# EAGLE schematic PAC-S10 & S1 SSUB (EAGLE 9.6.2)

## Sheet 1 of 4
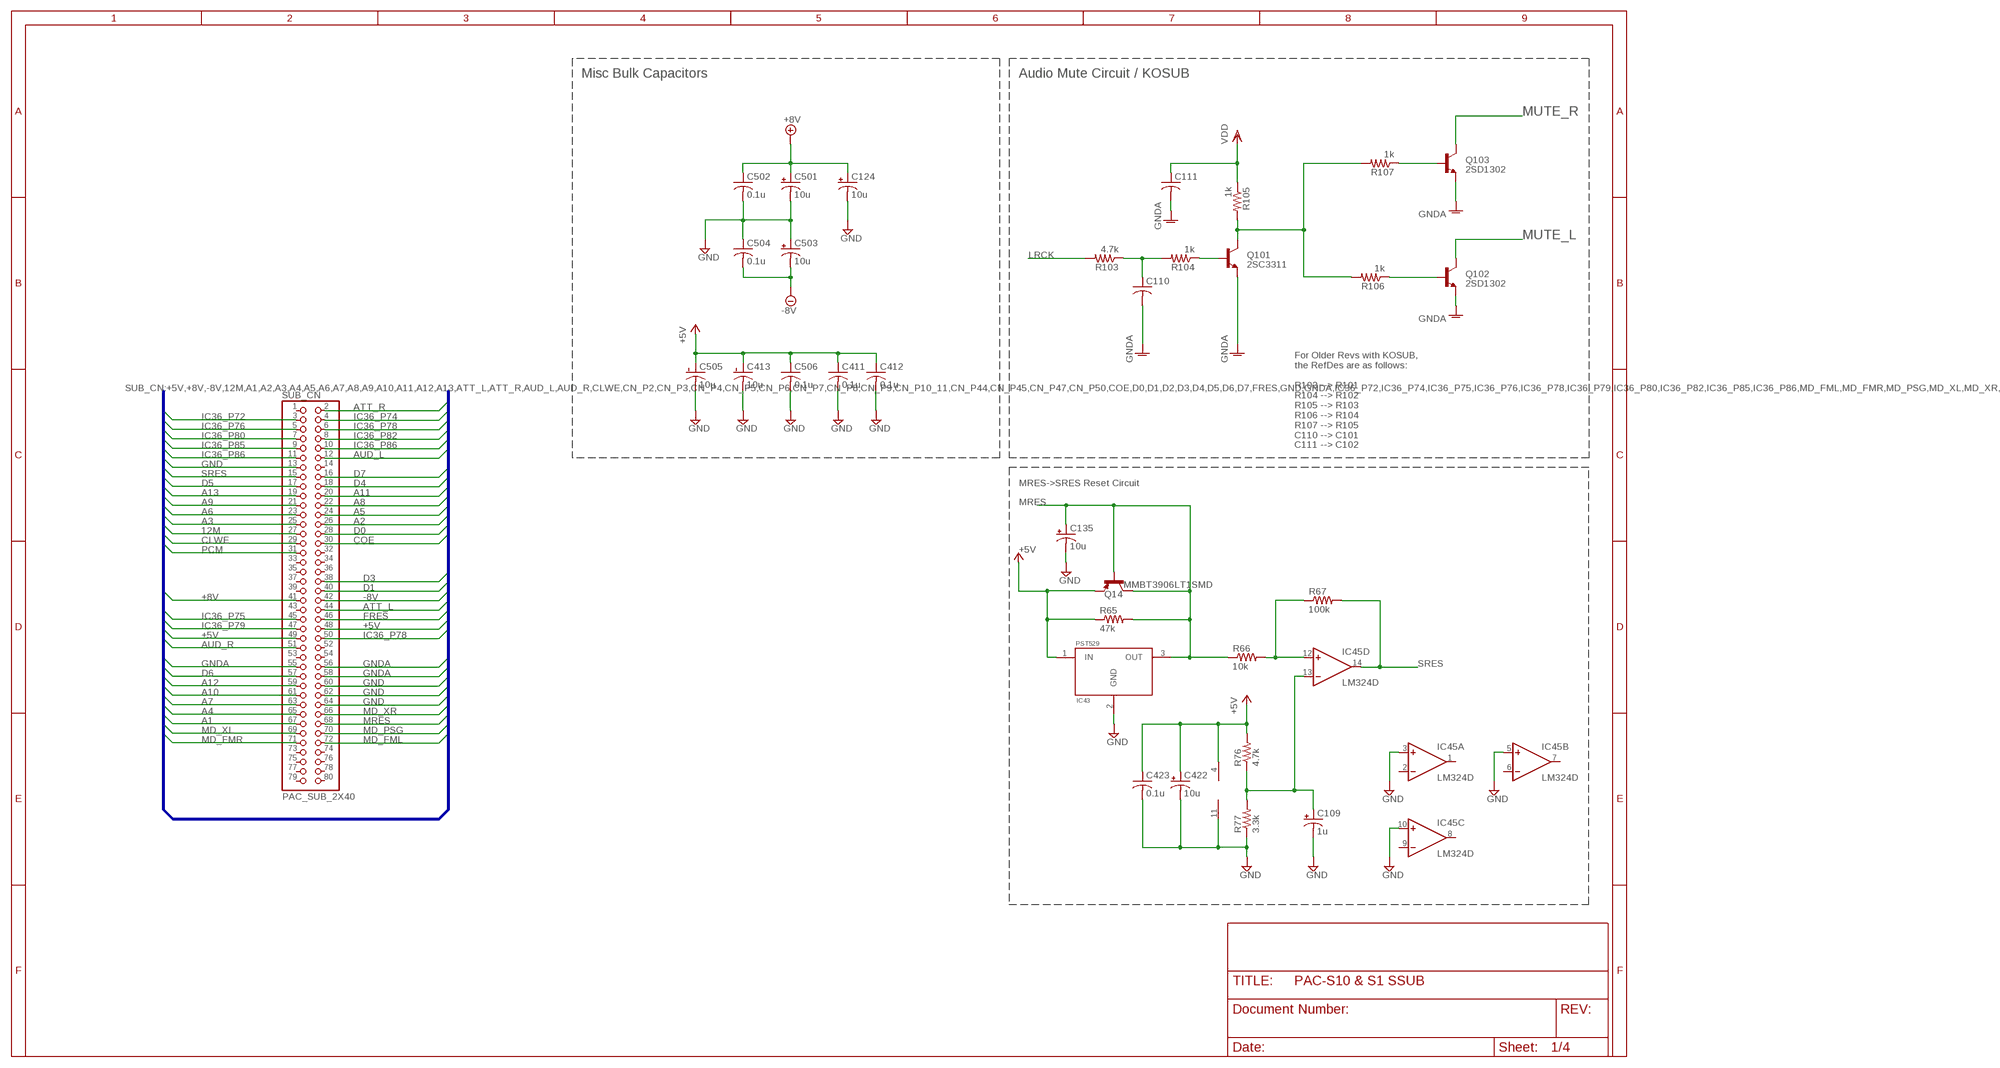
[diagram p0: schematic, sheet 1]

### Parts
C109  1u  CPOL-USB  [PANASONIC_B]
C110  C-USC1210  [C1210]
C111  C-USC0805  [C0805]
C124  10u  CPOL-USB  [PANASONIC_B]
C135  10u  CPOL-USB  [PANASONIC_B]
C411  0.1u  C-USC0805  [C0805]
C412  0.1u  C-USC0805  [C0805]
C413  10u  CPOL-USB  [PANASONIC_B]
C422  10u  CPOL-USB  [PANASONIC_B]
C423  0.1u  C-USC0805  [C0805]
C501  10u  CPOL-USB  [PANASONIC_B]
C502  0.1u  C-USC0805  [C0805]
C503  10u  CPOL-USB  [PANASONIC_B]
C504  0.1u  C-USC0805  [C0805]
C505  10u  CPOL-USB  [PANASONIC_B]
C506  0.1u  C-USC0805  [C0805]
IC43  PST529  [TO92-]
IC45  LM324D  [SO14]
Q14  MMBT3906LT1SMD  [SOT23-BEC]
Q101  MMBT3904LT1-NPN-SOT23-BEC  [SOT23-BEC]
Q102  MMBT3904LT1-NPN-SOT23-BEC  [SOT23-BEC]
Q103  MMBT3904LT1-NPN-SOT23-BEC  [SOT23-BEC]
R65  47k  R-US_R0805  [R0805]
R66  10k  R-US_R0805  [R0805]
R67  100k  R-US_R0805  [R0805]
R76  4.7k  R-US_R0805  [R0805]
R77  3.3k  R-US_R0805  [R0805]
R103  4.7k  R-US_R0805  [R0805]
R104  1k  R-US_R0805  [R0805]
R105  1k  R-US_R0805  [R0805]
R106  1k  R-US_R0805  [R0805]
R107  1k  R-US_R0805  [R0805]
SUB_CN  PAC_SUB_2X40  [2X40_STG]

### Nets
12M: SUB_CN.27 ; also sheet 3
+5V: C411.1 C412.1 C413.+ C422.+ C423.1 C505.+ C506.1 IC43.1(IN) IC45.4(P:V+) Q14.E R65.1 R76.2 SUB_CN.48 SUB_CN.49 ; also sheet 2,3
+8V: C124.+ C501.+ C502.1 SUB_CN.41 ; also sheet 2,3,4
-8V: C503.- C504.2 SUB_CN.42 ; also sheet 2,4
A1: SUB_CN.67 ; also sheet 3
A2: SUB_CN.26 ; also sheet 3
A3: SUB_CN.25 ; also sheet 3
A4: SUB_CN.65 ; also sheet 3
A5: SUB_CN.24 ; also sheet 3
A6: SUB_CN.23 ; also sheet 3
A7: SUB_CN.63 ; also sheet 3
A8: SUB_CN.22 ; also sheet 3
A9: SUB_CN.21 ; also sheet 3
A10: SUB_CN.61 ; also sheet 3
A11: SUB_CN.20 ; also sheet 3
A12: SUB_CN.59 ; also sheet 3
A13: SUB_CN.19 ; also sheet 3
ATT_L: SUB_CN.44 ; also sheet 2
ATT_R: SUB_CN.2 ; also sheet 2
AUD_L: SUB_CN.12 ; also sheet 4
AUD_R: SUB_CN.51 ; also sheet 4
CLWE: SUB_CN.29 ; also sheet 3
COE: SUB_CN.30 ; also sheet 3
D0: SUB_CN.28 ; also sheet 3
D1: SUB_CN.40 ; also sheet 3
D3: SUB_CN.38 ; also sheet 3
D4: SUB_CN.18 ; also sheet 3
D5: SUB_CN.17 ; also sheet 3
D6: SUB_CN.57 ; also sheet 3
D7: SUB_CN.16 ; also sheet 3
FRES: SUB_CN.46 ; also sheet 3
GND: C109.- C124.- C135.- C411.2 C412.2 C413.- C422.- C423.2 C501.- C502.2 C503.+ C504.1 C505.- C506.2 IC43.2(GND) IC45.3(A:+IN) IC45.5(B:+IN) IC45.10(C:+IN) IC45.11(P:V-) R77.1 SUB_CN.13 SUB_CN.60 SUB_CN.62 SUB_CN.64 ; also sheet 2,3
GNDA: C110.2 C111.2 Q101.E Q102.E Q103.E SUB_CN.55 SUB_CN.56 SUB_CN.58 ; also sheet 3,4
IC36_P72: SUB_CN.3 ; also sheet 2
IC36_P74: SUB_CN.4 ; also sheet 2
IC36_P75: SUB_CN.45 ; also sheet 2
IC36_P76: SUB_CN.5 ; also sheet 2
IC36_P78: SUB_CN.6 SUB_CN.50 ; also sheet 2
IC36_P79: SUB_CN.47 ; also sheet 2
IC36_P80: SUB_CN.7 ; also sheet 2
IC36_P82: SUB_CN.8 ; also sheet 2
IC36_P85: SUB_CN.9 ; also sheet 2
IC36_P86: SUB_CN.10 SUB_CN.11 ; also sheet 2
LRCK: R103.2 ; also sheet 3
MD_FML: SUB_CN.72 ; also sheet 4
MD_FMR: SUB_CN.71 ; also sheet 4
MD_PSG: SUB_CN.70 ; also sheet 4
MD_XL: SUB_CN.69 ; also sheet 4
MD_XR: SUB_CN.66 ; also sheet 4
MRES: C135.+ IC43.3(OUT) Q14.B Q14.C R65.2 R66.1 SUB_CN.68
MUTE_L: Q102.C ; also sheet 4
MUTE_R: Q103.C ; also sheet 4
N$12: IC45.12(D:+IN) R66.2 R67.1
N$24: Q101.B R104.1
N$25: C110.1 R103.1 R104.2
N$26: C109.+ IC45.13(D:-IN) R76.1 R77.2
N$27: Q101.C R105.2 R106.2 R107.2
N$29: Q102.B R106.1
N$30: Q103.B R107.1
PCM: SUB_CN.31 ; also sheet 3
SRES: IC45.14(D:OUT) R67.2 SUB_CN.15
VDD: C111.1 R105.1 ; also sheet 3
Unconnected: IC45.1(A:OUT) IC45.2(A:-IN) IC45.6(B:-IN) IC45.7(B:OUT) IC45.8(C:OUT) IC45.9(C:-IN) SUB_CN.1 SUB_CN.14 SUB_CN.32 SUB_CN.33 SUB_CN.34 SUB_CN.35 SUB_CN.36 SUB_CN.37 SUB_CN.39 SUB_CN.43 SUB_CN.52 SUB_CN.53 SUB_CN.54 SUB_CN.73 SUB_CN.74 SUB_CN.75 SUB_CN.76 SUB_CN.77 SUB_CN.78 SUB_CN.79 SUB_CN.80

### Buses
SUB_CN:+5V,+8V,-8V,12M,A1,A2,A3,A4,A5,A6,A7,A8,A9,A10,A11,A12,A13,ATT_L,ATT_R,AUD_L,AUD_R,CLWE,CN_P2,CN_P3,CN_P4,CN_P5,CN_P6,CN_P7,CN_P8,CN_P9,CN_P10_11,CN_P44,CN_P45,CN_P47,CN_P50,COE,D0,D1,D2,D3,D4,D5,D6,D7,FRES,GND,GNDA,IC36_P72,IC36_P74,IC36_P75,IC36_P76,IC36_P78,IC36_P79,IC36_P80,IC36_P82,IC36_P85,IC36_P86,MD_FML,MD_FMR,MD_PSG,MD_XL,MD_XR,MRES,PCM,SRES

### Notes on the sheet
- Misc Bulk Capacitors | Audio Mute Circuit / KOSUB
- 2SD1302
- 2SC3311
- 2SD1302
- For Older Revs with KOSUB,
  the RefDes are as follows:
  
  R103 --> R101
  R104 --> R102
  R105 --> R103
  R106 --> R104
  R107 --> R105
  C110 --> C101
  C111 --> C102
- MRES->SRES Reset Circuit

## Sheet 2 of 4
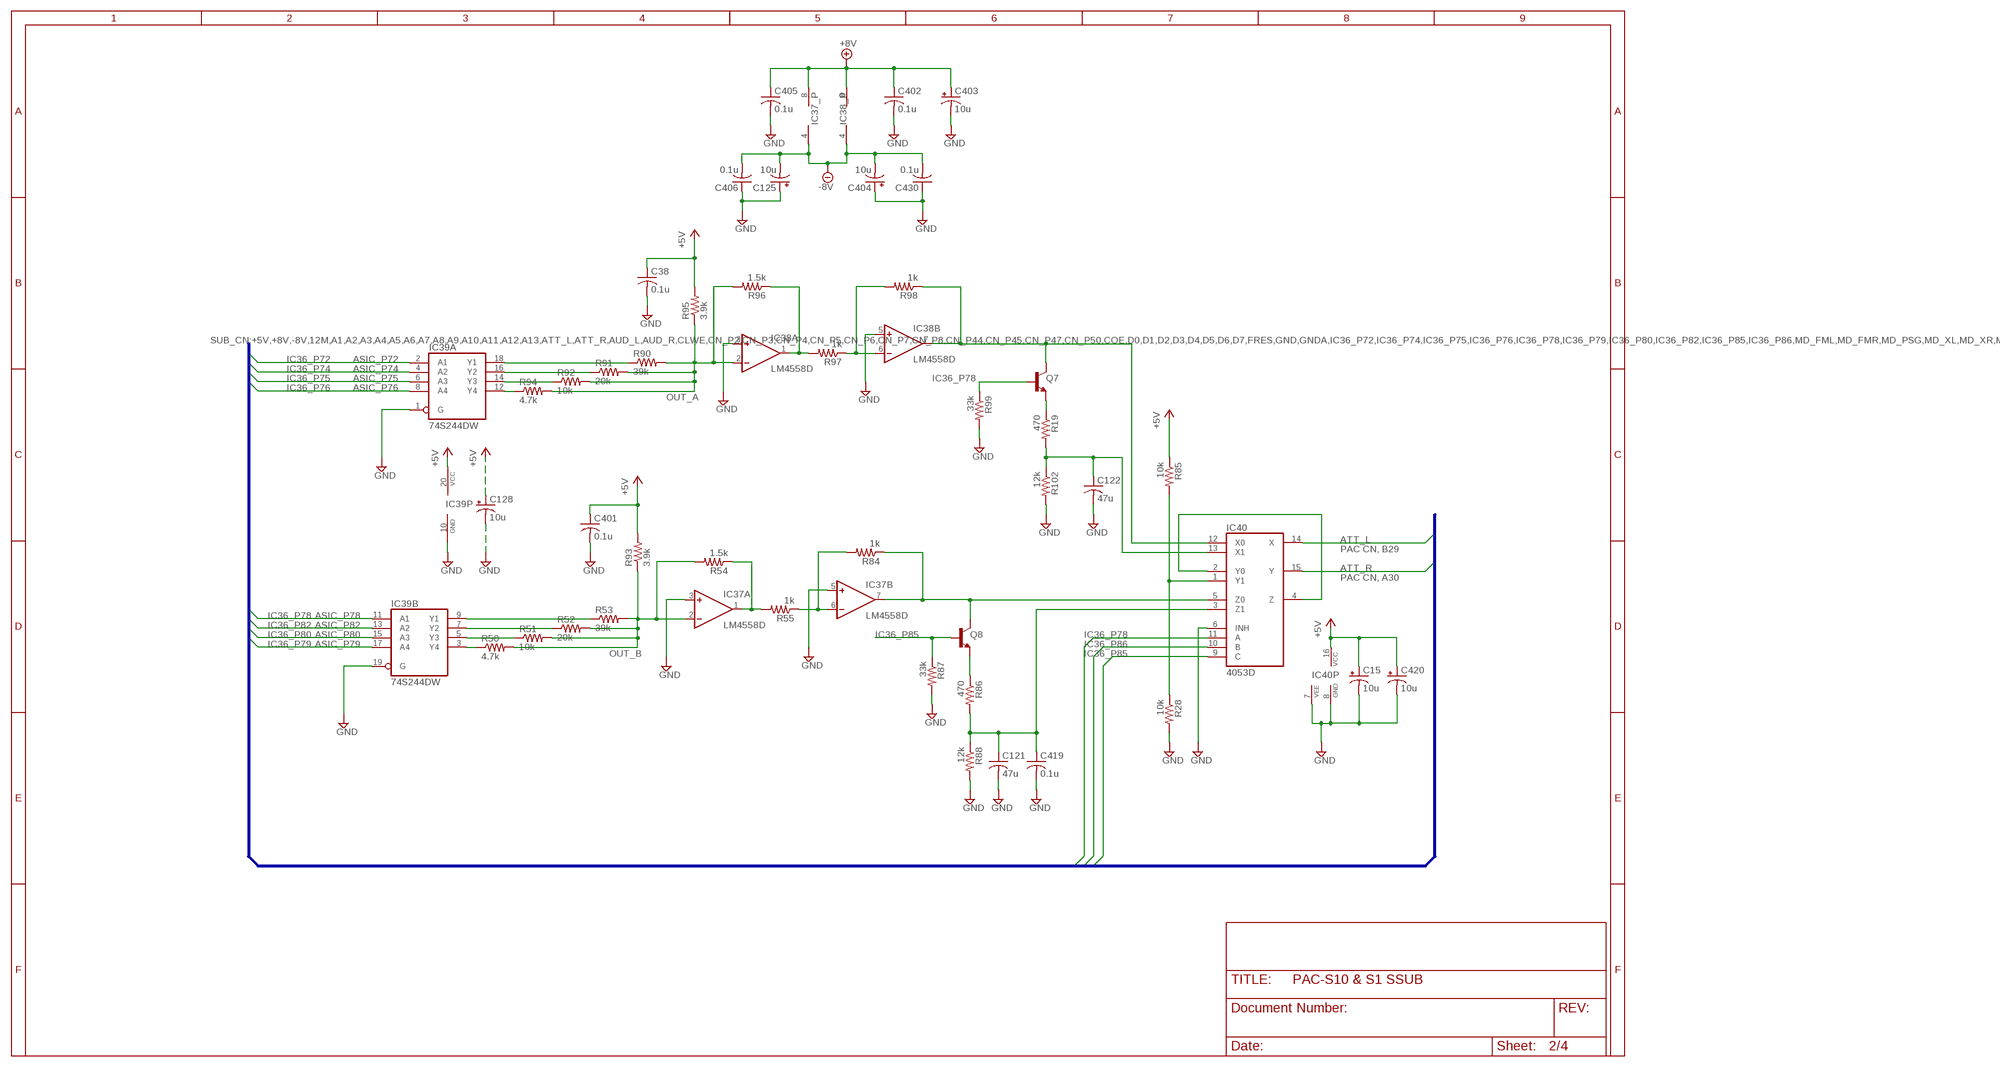
[diagram p1: schematic, sheet 2]

### Parts
C15  10u  CPOL-USB  [PANASONIC_B]
C38  0.1u  C-USC0805  [C0805]
C121  47u  C-USC2220K  [C2220K]
C122  47u  C-USC2220K  [C2220K]
C125  10u  CPOL-USB  [PANASONIC_B]
C128  10u  CPOL-USB  [PANASONIC_B]
C401  0.1u  C-USC0805  [C0805]
C402  0.1u  C-USC0805  [C0805]
C403  10u  CPOL-USB  [PANASONIC_B]
C404  10u  CPOL-USB  [PANASONIC_B]
C405  0.1u  C-USC0805  [C0805]
C406  0.1u  C-USC0805  [C0805]
C419  0.1u  C-USC0805  [C0805]
C420  10u  CPOL-USB  [PANASONIC_B]
C430  0.1u  C-USC0805  [C0805]
IC37  LM4558D  [SO08]
IC38  LM4558D  [SO08]
IC39  74S244DW  [SO20W]
IC40  4053D  [SO16]
Q7  MMBT3904LT1-NPN-SOT23-BEC  [SOT23-BEC]
Q8  MMBT3904LT1-NPN-SOT23-BEC  [SOT23-BEC]
R19  470  R-US_R0805  [R0805]
R28  10k  R-US_R0805  [R0805]
R50  4.7k  R-US_R0805  [R0805]
R51  10k  R-US_R0805  [R0805]
R52  20k  R-US_R0805  [R0805]
R53  39k  R-US_R0805  [R0805]
R54  1.5k  R-US_R0805  [R0805]
R55  1k  R-US_R0805  [R0805]
R84  1k  R-US_R0805  [R0805]
R85  10k  R-US_R0805  [R0805]
R86  470  R-US_R0805  [R0805]
R87  33k  R-US_R0805  [R0805]
R88  12k  R-US_R0805  [R0805]
R90  39k  R-US_R0805  [R0805]
R91  20k  R-US_R0805  [R0805]
R92  10k  R-US_R0805  [R0805]
R93  3.9k  R-US_R0805  [R0805]
R94  4.7k  R-US_R0805  [R0805]
R95  3.9k  R-US_R0805  [R0805]
R96  1.5k  R-US_R0805  [R0805]
R97  1k  R-US_R0805  [R0805]
R98  1k  R-US_R0805  [R0805]
R99  33k  R-US_R0805  [R0805]
R102  12k  R-US_R0805  [R0805]

### Nets
+5V: C15.+ C38.1 C128.+ C401.1 C420.+ IC39.20(P:VCC) IC40.16(VCC) R85.1 R93.2 R95.2 ; also sheet 1,3
+8V: C402.1 C403.+ C405.1 IC37.8(P:V+) IC38.8(P:V+) ; also sheet 1,3,4
-8V: C125.- C404.- C406.2 C430.2 IC37.4(P:V-) IC38.4(P:V-) ; also sheet 1,4
ATT_L: IC40.14(X) ; also sheet 1
ATT_R: IC40.15(Y) ; also sheet 1
GND: C15.- C38.2 C121.2 C122.2 C125.+ C128.- C401.2 C402.2 C403.- C404.+ C405.2 C406.1 C419.2 C420.- C430.1 IC37.3(A:+IN) IC37.5(B:+IN) IC38.3(A:+IN) IC38.5(B:+IN) IC39.1(A:G) IC39.10(P:GND) IC39.19(B:G) IC40.6(INH) IC40.7(VEE) IC40.8(GND) R28.2 R87.2 R88.2 R99.2 R102.2 ; also sheet 1,3
IC36_P72: IC39.2(A:A1) ; also sheet 1
IC36_P74: IC39.4(A:A2) ; also sheet 1
IC36_P75: IC39.6(A:A3) ; also sheet 1
IC36_P76: IC39.8(A:A4) ; also sheet 1
IC36_P78: IC39.11(B:A1) IC40.11(A) Q7.B R99.1 ; also sheet 1
IC36_P79: IC39.17(B:A4) ; also sheet 1
IC36_P80: IC39.15(B:A3) ; also sheet 1
IC36_P82: IC39.13(B:A2) ; also sheet 1
IC36_P85: IC40.9(C) Q8.B R87.1 ; also sheet 1
IC36_P86: IC40.10(B) ; also sheet 1
IC40_P3: C121.1 C419.1 IC40.3(Z1) R86.2 R88.1
N$1: IC39.3(B:Y4) R50.1
N$2: IC39.5(B:Y3) R51.1
N$3: IC39.7(B:Y2) R52.1
N$4: IC39.9(B:Y1) R53.1
N$5: IC37.1(A:OUT) R54.1 R55.2
N$6: IC39.12(A:Y4) R94.1
N$7: IC39.14(A:Y3) R92.1
N$8: IC39.16(A:Y2) R91.1
N$9: IC39.18(A:Y1) R90.1
N$10: IC40.2(Y0) IC40.4(Z)
N$11: IC37.6(B:-IN) R55.1 R84.2
N$13: Q8.E R86.1
N$14: IC40.1(Y1) R28.1 R85.2
N$15: IC38.6(B:-IN) R97.1 R98.2
N$16: IC38.1(A:OUT) R96.1 R97.2
N$17: IC37.7(B:OUT) IC40.5(Z0) Q8.C R84.1
N$18: IC38.7(B:OUT) IC40.12(X0) Q7.C R98.1
N$19: Q7.E R19.1
N$20: C122.1 IC40.13(X1) R19.2 R102.1
OUT_A: IC38.2(A:-IN) R90.2 R91.2 R92.2 R94.2 R95.1 R96.2
OUT_B: IC37.2(A:-IN) R50.2 R51.2 R52.2 R53.2 R54.2 R93.1

### Buses
SUB_CN:+5V,+8V,-8V,12M,A1,A2,A3,A4,A5,A6,A7,A8,A9,A10,A11,A12,A13,ATT_L,ATT_R,AUD_L,AUD_R,CLWE,CN_P2,CN_P3,CN_P4,CN_P5,CN_P6,CN_P7,CN_P8,CN_P44,CN_P45,CN_P47,CN_P50,COE,D0,D1,D2,D3,D4,D5,D6,D7,FRES,GND,GNDA,IC36_P72,IC36_P74,IC36_P75,IC36_P76,IC36_P78,IC36_P79,IC36_P80,IC36_P82,IC36_P85,IC36_P86,MD_FML,MD_FMR,MD_PSG,MD_XL,MD_XR,MRES,PCM,SRES

### Notes on the sheet
- IC37_P | IC38_P
- ASIC_P72
- ASIC_P74
- ASIC_P75
- ASIC_P76
- PAC CN, B29
- PAC CN, A30
- ASIC_P78
- ASIC_P82
- ASIC_P80
- ASIC_P79

## Sheet 3 of 4
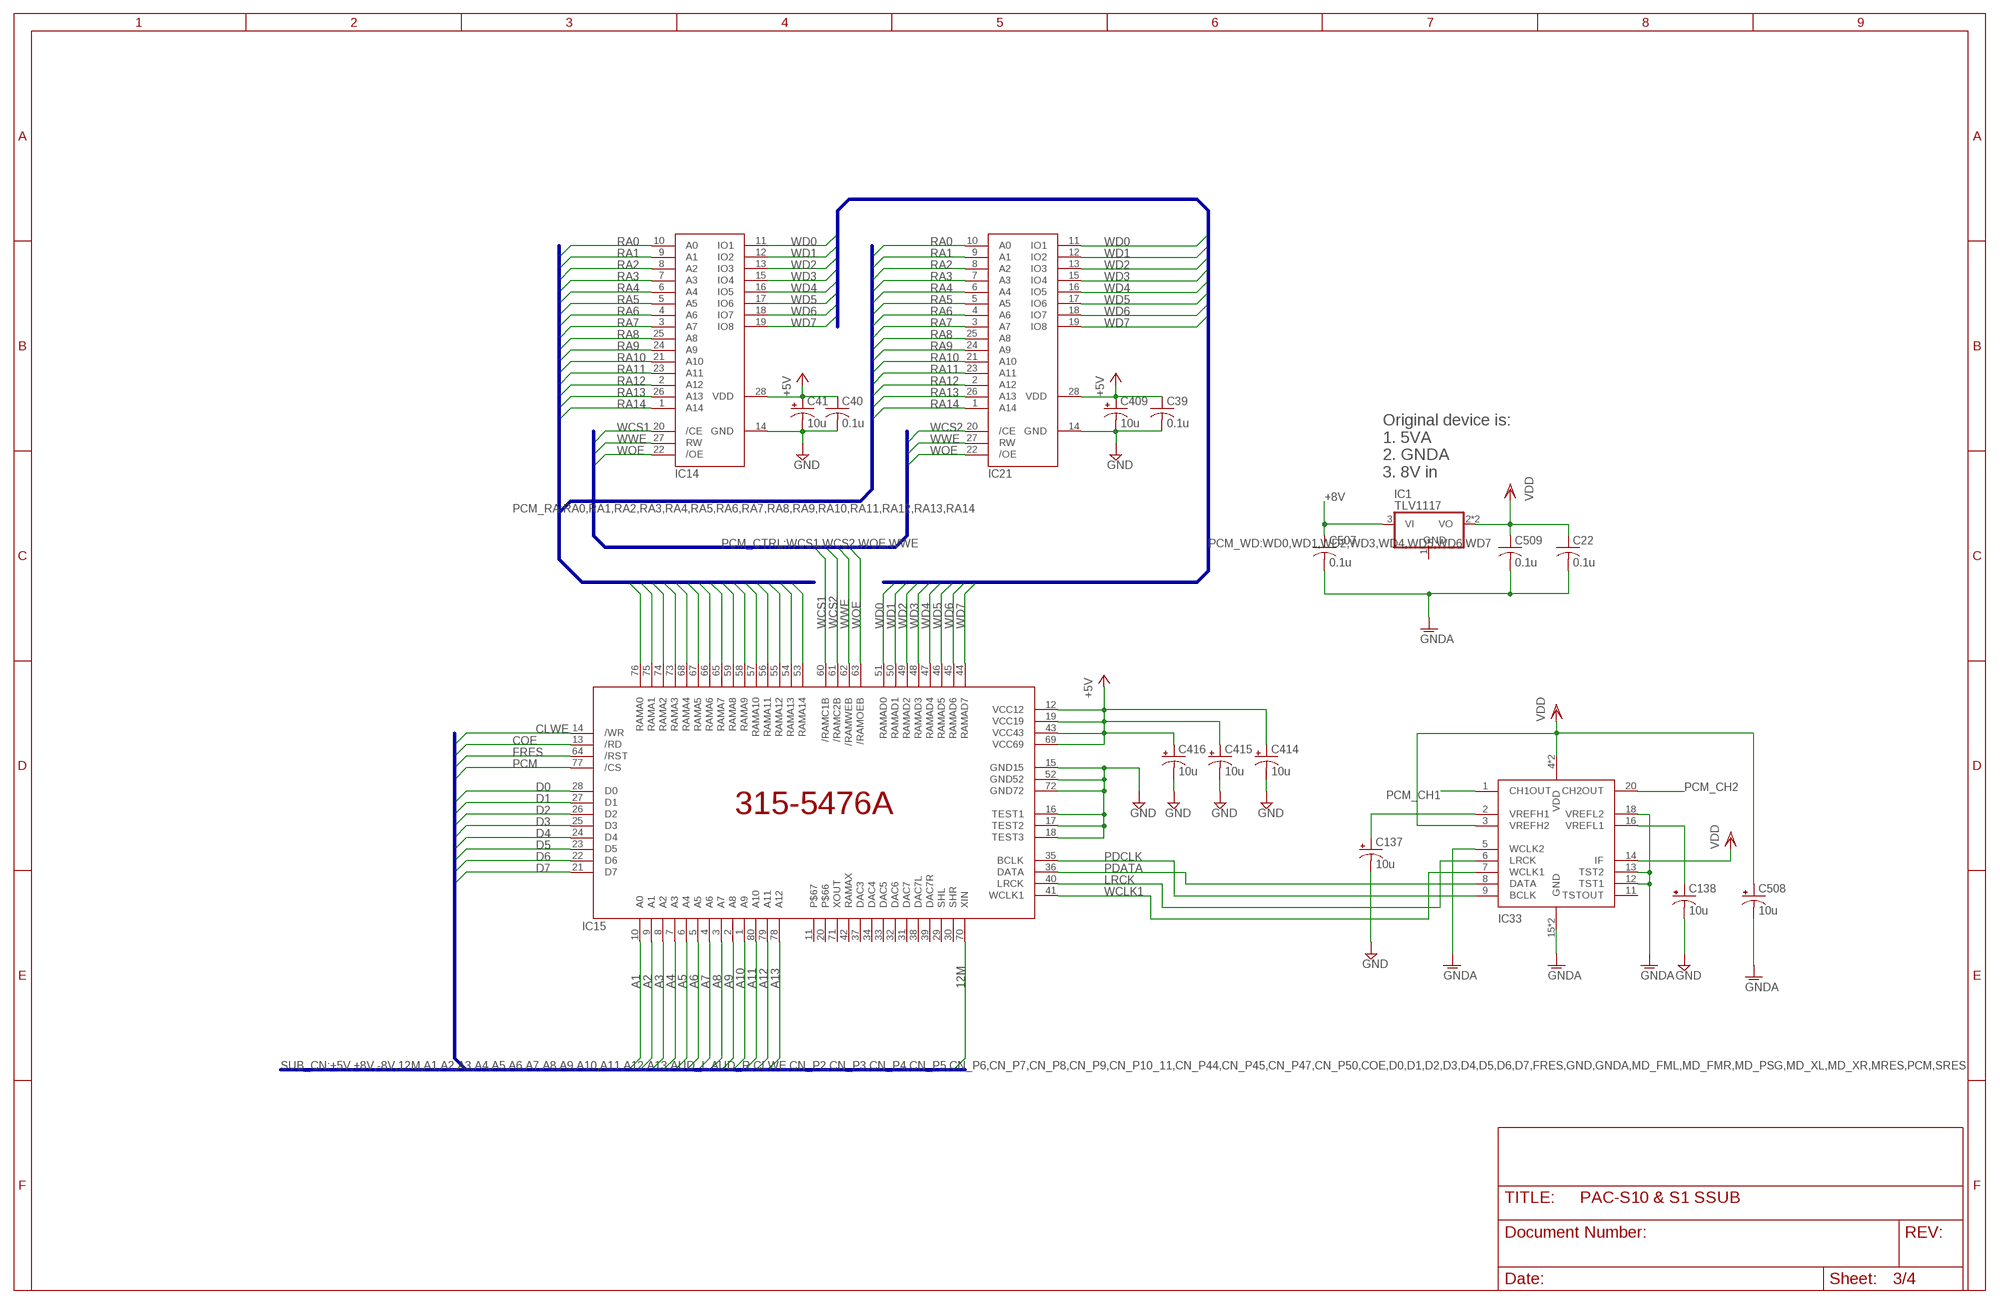
[diagram p2: schematic, sheet 3]

### Parts
C22  0.1u  C-USC0805  [C0805]
C39  0.1u  C-USC0805  [C0805]
C40  0.1u  C-USC0805  [C0805]
C41  10u  CPOL-USB  [PANASONIC_B]
C137  10u  CPOL-USB  [PANASONIC_B]
C138  10u  CPOL-USB  [PANASONIC_B]
C409  10u  CPOL-USB  [PANASONIC_B]
C414  10u  CPOL-USB  [PANASONIC_B]
C415  10u  CPOL-USB  [PANASONIC_B]
C416  10u  CPOL-USB  [PANASONIC_B]
C507  0.1u  C-USC0805  [C0805]
C508  10u  CPOL-USB  [PANASONIC_B]
C509  0.1u  C-USC0805  [C0805]
IC1  TLV1117  [SOT223]
IC14  TC51832F-10  [SOP28]
IC15  315-5476A  [QFP80R]
IC21  TC51832F-10  [SOP28]
IC33  LC7881M  [SOIC20S]

### Nets
12M: IC15.70(XIN) ; also sheet 1
+5V: C39.1 C40.1 C41.+ C409.+ C414.+ C415.+ C416.+ IC14.28(VDD) IC15.12(VCC12) IC15.19(VCC19) IC15.43(VCC43) IC15.69(VCC69) IC21.28(VDD) ; also sheet 1,2
+8V: C507.1 IC1.3(VI) ; also sheet 1,2,4
A1: IC15.10(A0) ; also sheet 1
A2: IC15.9(A1) ; also sheet 1
A3: IC15.8(A2) ; also sheet 1
A4: IC15.7(A3) ; also sheet 1
A5: IC15.6(A4) ; also sheet 1
A6: IC15.5(A5) ; also sheet 1
A7: IC15.4(A6) ; also sheet 1
A8: IC15.3(A7) ; also sheet 1
A9: IC15.2(A8) ; also sheet 1
A10: IC15.1(A9) ; also sheet 1
A11: IC15.80(A10) ; also sheet 1
A12: IC15.79(A11) ; also sheet 1
A13: IC15.78(A12) ; also sheet 1
CLWE: IC15.14(/WR) ; also sheet 1
COE: IC15.13(/RD) ; also sheet 1
D0: IC15.28(D0) ; also sheet 1
D1: IC15.27(D1) ; also sheet 1
D2: IC15.26(D2)
D3: IC15.25(D3) ; also sheet 1
D4: IC15.24(D4) ; also sheet 1
D5: IC15.23(D5) ; also sheet 1
D6: IC15.22(D6) ; also sheet 1
D7: IC15.21(D7) ; also sheet 1
FRES: IC15.64(/RST) ; also sheet 1
GND: C39.2 C40.2 C41.- C137.- C138.- C409.- C414.- C415.- C416.- IC14.14(GND) IC15.15(GND15) IC15.16(TEST1) IC15.17(TEST2) IC15.18(TEST3) IC15.52(GND52) IC15.72(GND72) IC21.14(GND) IC33.15(GND) IC33.17(GND) ; supply symbol labelled GNDA ; also sheet 1,2
GNDA: C22.2 C507.2 C508.- C509.2 IC33.5(WCLK2) IC33.12(TST1) IC33.13(TST2) IC33.18(VREFL2) ; also sheet 1,4
LRCK: IC15.40(LRCK) IC33.6(LRCK) ; also sheet 1
N$21: C138.+ IC33.16(VREFL1)
N$22: C137.+ IC33.2(VREFH1)
PCM: IC15.77(/CS) ; also sheet 1
PCM_CH1: IC33.1(CH1OUT) ; also sheet 4
PCM_CH2: IC33.20(CH2OUT) ; also sheet 4
PDATA: IC15.36(DATA) IC33.8(DATA)
PDCLK: IC15.35(BCLK) IC33.9(BCLK)
RA0: IC14.10(A0) IC15.76(RAMA0) IC21.10(A0)
RA1: IC14.9(A1) IC15.75(RAMA1) IC21.9(A1)
RA2: IC14.8(A2) IC15.74(RAMA2) IC21.8(A2)
RA3: IC14.7(A3) IC15.73(RAMA3) IC21.7(A3)
RA4: IC14.6(A4) IC15.68(RAMA4) IC21.6(A4)
RA5: IC14.5(A5) IC15.67(RAMA5) IC21.5(A5)
RA6: IC14.4(A6) IC15.66(RAMA6) IC21.4(A6)
RA7: IC14.3(A7) IC15.65(RAMA7) IC21.3(A7)
RA8: IC14.25(A8) IC15.59(RAMA8) IC21.25(A8)
RA9: IC14.24(A9) IC15.58(RAMA9) IC21.24(A9)
RA10: IC14.21(A10) IC15.57(RAMA10) IC21.21(A10)
RA11: IC14.23(A11) IC15.56(RAMA11) IC21.23(A11)
RA12: IC14.2(A12) IC15.55(RAMA12) IC21.2(A12)
RA13: IC14.26(A13) IC15.54(RAMA13) IC21.26(A13)
RA14: IC14.1(A14) IC15.53(RAMA14) IC21.1(A14)
VDD: C22.1 C508.+ C509.1 IC1.2(VO) IC1.4(VO) IC33.3(VREFH2) IC33.4(VDD) IC33.10(VDD) IC33.14(IF) ; also sheet 1
WCLK1: IC15.41(WCLK1) IC33.7(WCLK1)
WCS1: IC14.20(/CE) IC15.60(/RAMC1B)
WCS2: IC15.61(/RAMC2B) IC21.20(/CE)
WD0: IC14.11(IO1) IC15.51(RAMAD0) IC21.11(IO1)
WD1: IC14.12(IO2) IC15.50(RAMAD1) IC21.12(IO2)
WD2: IC14.13(IO3) IC15.49(RAMAD2) IC21.13(IO3)
WD3: IC14.15(IO4) IC15.48(RAMAD3) IC21.15(IO4)
WD4: IC14.16(IO5) IC15.47(RAMAD4) IC21.16(IO5)
WD5: IC14.17(IO6) IC15.46(RAMAD5) IC21.17(IO6)
WD6: IC14.18(IO7) IC15.45(RAMAD6) IC21.18(IO7)
WD7: IC14.19(IO8) IC15.44(RAMAD7) IC21.19(IO8)
WOE: IC14.22(/OE) IC15.63(/RAMOEB) IC21.22(/OE)
WWE: IC14.27(RW) IC15.62(/RAMWEB) IC21.27(RW)
Unconnected: IC1.1(GND) IC15.11 IC15.20 IC15.29(SHL) IC15.30(SHR) IC15.31(DAC7) IC15.32(DAC6) IC15.33(DAC5) IC15.34(DAC4) IC15.37(DAC3) IC15.38(DAC7L) IC15.39(DAC7R) IC15.42(RAMAX) IC15.71(XOUT) IC33.11(TSTOUT)

### Buses
SUB_CN:+5V,+8V,-8V,12M,A1,A2,A3,A4,A5,A6,A7,A8,A9,A10,A11,A12,A13,AUD_L,AUD_R,CLWE,CN_P2,CN_P3,CN_P4,CN_P5,CN_P6,CN_P7,CN_P8,CN_P9,CN_P10_11,CN_P44,CN_P45,CN_P47,CN_P50,COE,D0,D1,D2,D3,D4,D5,D6,D7,FRES,GND,GNDA,MD_FML,MD_FMR,MD_PSG,MD_XL,MD_XR,MRES,PCM,SRES
PCM_RA:RA0,RA1,RA2,RA3,RA4,RA5,RA6,RA7,RA8,RA9,RA10,RA11,RA12,RA13,RA14
PCM_WD:WD0,WD1,WD2,WD3,WD4,WD5,WD6,WD7
PCM_CTRL:WCS1,WCS2,WOE,WWE

### Notes on the sheet
- Original device is:
  1. 5VA
  2. GNDA
  3. 8V in

## Sheet 4 of 4
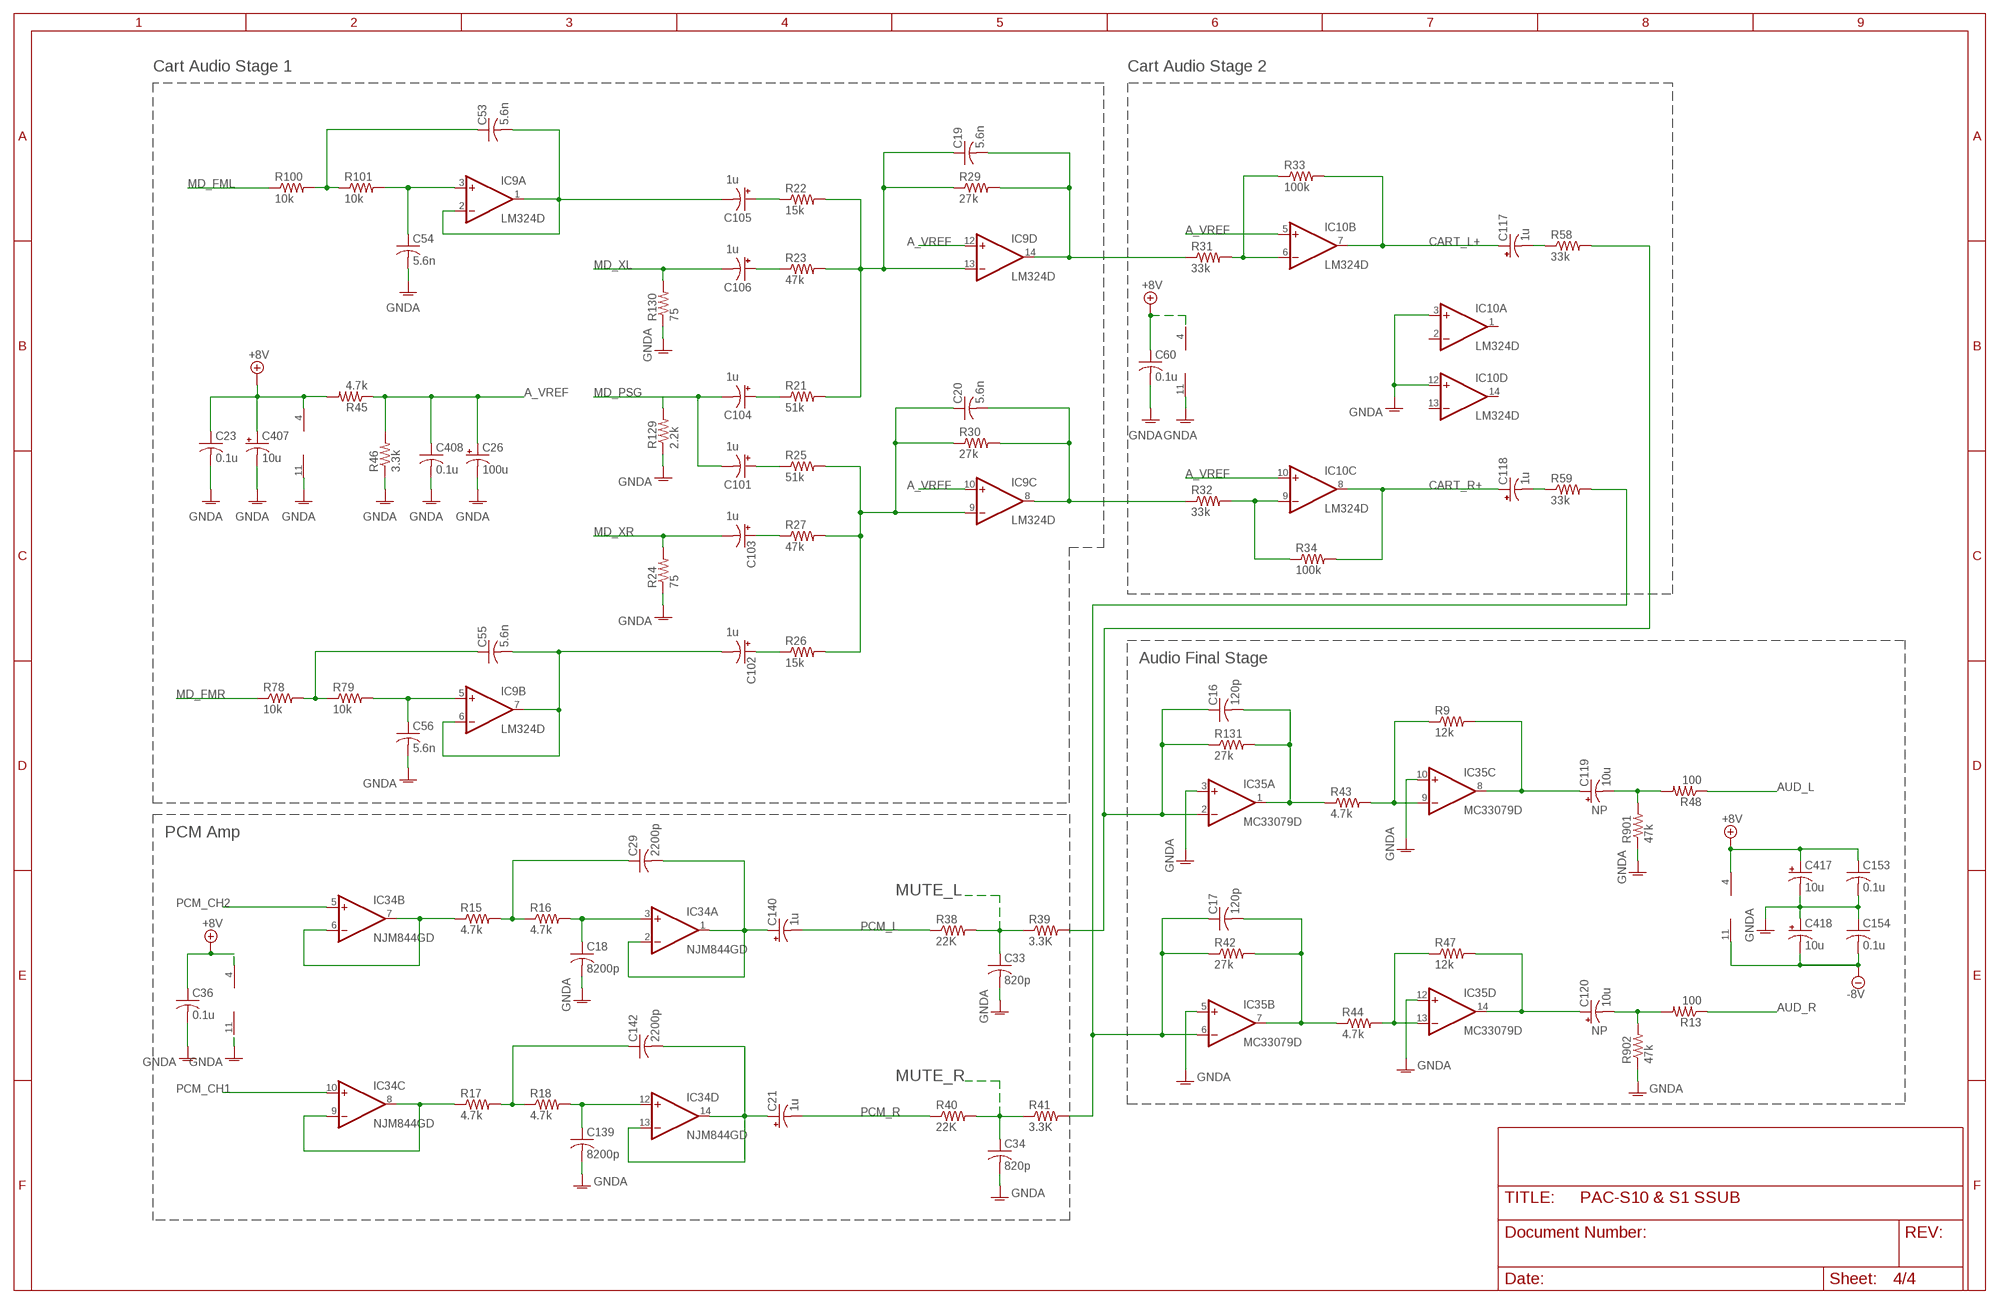
[diagram p3: schematic, sheet 4]

### Parts
C16  120p  C-USC0805  [C0805]
C17  120p  C-USC0805  [C0805]
C18  8200p  C-USC0805  [C0805]
C19  5.6n  C-USC0805  [C0805]
C20  5.6n  C-USC0805  [C0805]
C21  1u  CPOL-USD  [PANASONIC_D]
C23  0.1u  C-USC0805  [C0805]
C26  100u  CPOL-USE  [PANASONIC_E]
C29  2200p  C-USC0805  [C0805]
C33  820p  C-USC0805  [C0805]
C34  820p  C-USC0805  [C0805]
C36  0.1u  C-USC0805  [C0805]
C53  5.6n  C-USC0805  [C0805]
C54  5.6n  C-USC0805  [C0805]
C55  5.6n  C-USC0805  [C0805]
C56  5.6n  C-USC0805  [C0805]
C60  0.1u  C-USC0805  [C0805]
C101  1u  CPOL-USC  [PANASONIC_C]
C102  1u  CPOL-USC  [PANASONIC_C]
C103  1u  CPOL-USC  [PANASONIC_C]
C104  1u  CPOL-USC  [PANASONIC_C]
C105  1u  CPOL-USC  [PANASONIC_C]
C106  1u  CPOL-USC  [PANASONIC_C]
C117  1u  CPOL-USD  [PANASONIC_D]
C118  1u  CPOL-USD  [PANASONIC_D]
C119  10u  CPOL-USD  [PANASONIC_D]
C120  10u  CPOL-USD  [PANASONIC_D]
C139  8200p  C-USC0805  [C0805]
C140  1u  CPOL-USD  [PANASONIC_D]
C142  2200p  C-USC0805  [C0805]
C153  0.1u  C-USC0805  [C0805]
C154  0.1u  C-USC0805  [C0805]
C407  10u  CPOL-USB  [PANASONIC_B]
C408  0.1u  C-USC0805  [C0805]
C417  10u  CPOL-USB  [PANASONIC_B]
C418  10u  CPOL-USB  [PANASONIC_B]
IC9  LM324D  [SO14]
IC10  LM324D  [SO14]
IC34  NJM844GD  [SO14]
IC35  MC33079D  [SO14]
R9  12k  R-US_R0805  [R0805]
R13  100  R-US_R0805  [R0805]
R15  4.7k  R-US_R0805  [R0805]
R16  4.7k  R-US_R0805  [R0805]
R17  4.7k  R-US_R0805  [R0805]
R18  4.7k  R-US_R0805  [R0805]
R21  51k  R-US_R0805  [R0805]
R22  15k  R-US_R0805  [R0805]
R23  47k  R-US_R0805  [R0805]
R24  75  R-US_R0805  [R0805]
R25  51k  R-US_R0805  [R0805]
R26  15k  R-US_R0805  [R0805]
R27  47k  R-US_R0805  [R0805]
R29  27k  R-US_R0805  [R0805]
R30  27k  R-US_R0805  [R0805]
R31  33k  R-US_R0805  [R0805]
R32  33k  R-US_R0805  [R0805]
R33  100k  R-US_R0805  [R0805]
R34  100k  R-US_R0805  [R0805]
R38  22K  R-US_R0805  [R0805]
R39  3.3K  R-US_R0805  [R0805]
R40  22K  R-US_R0805  [R0805]
R41  3.3K  R-US_R0805  [R0805]
R42  27k  R-US_R0805  [R0805]
R43  4.7k  R-US_R0805  [R0805]
R44  4.7k  R-US_R0805  [R0805]
R45  4.7k  R-US_R0805  [R0805]
R46  3.3k  R-US_R0805  [R0805]
R47  12k  R-US_R0805  [R0805]
R48  100  R-US_R0805  [R0805]
R58  33k  R-US_R0805  [R0805]
R59  33k  R-US_R0805  [R0805]
R78  10k  R-US_R0805  [R0805]
R79  10k  R-US_R0805  [R0805]
R100  10k  R-US_R0805  [R0805]
R101  10k  R-US_R0805  [R0805]
R129  2.2k  R-US_R0805  [R0805]
R130  75  R-US_R0805  [R0805]
R131  27k  R-US_R0805  [R0805]
R901  47k  R-US_R0805  [R0805]
R902  47k  R-US_R0805  [R0805]

### Nets
+8V: C23.1 C36.1 C60.1 C153.1 C407.+ C417.+ IC9.4(P:V+) IC10.4(P:V+) IC34.4(P:V+) IC35.4(P:V+) R45.2 ; also sheet 1,2,3
-8V: C154.2 C418.- IC35.11(P:V-) ; also sheet 1,2
A_VREF: C26.+ C408.1 IC9.10(C:+IN) IC9.12(D:+IN) IC10.5(B:+IN) IC10.10(C:+IN) R45.1 R46.2
AUD_L: R48.1 ; also sheet 1
AUD_R: R13.1 ; also sheet 1
CART_L: C117.- R58.1
CART_L+: C117.+ IC10.7(B:OUT) R33.2
CART_R: C118.- R59.1
CART_R+: C118.+ IC10.8(C:OUT) R34.2
GNDA: C18.2 C23.2 C26.- C33.2 C34.2 C36.2 C54.2 C56.2 C60.2 C139.2 C153.2 C154.1 C407.- C408.2 C417.- C418.+ IC9.11(P:V-) IC10.3(A:+IN) IC10.11(P:V-) IC10.12(D:+IN) IC34.11(P:V-) IC35.3(A:+IN) IC35.5(B:+IN) IC35.10(C:+IN) IC35.12(D:+IN) R24.1 R46.1 R129.1 R130.1 R901.1 R902.1 ; also sheet 1,3
MD_FML: R100.1 ; also sheet 1
MD_FMR: R78.1 ; also sheet 1
MD_PSG: C101.- C104.- R129.2 ; also sheet 1
MD_XL: C106.- R130.2 ; also sheet 1
MD_XR: C103.- R24.2 ; also sheet 1
MUTE_L: C33.1 R38.2 R39.1 ; also sheet 1
MUTE_R: C34.1 R40.2 R41.1 ; also sheet 1
N$32: C54.1 IC9.3(A:+IN) R101.2
N$33: C53.1 R100.2 R101.1
N$34: C56.1 IC9.5(B:+IN) R79.2
N$35: C53.2 C105.- IC9.1(A:OUT) IC9.2(A:-IN)
N$36: C55.2 C102.- IC9.6(B:-IN) IC9.7(B:OUT)
N$37: C55.1 R78.2 R79.1
N$38: C106.+ R23.1
N$39: C19.1 IC9.13(D:-IN) R21.2 R22.2 R23.2 R29.1
N$40: C104.+ R21.1
N$41: C101.+ R25.1
N$42: C105.+ R22.1
N$43: C20.1 IC9.9(C:-IN) R25.2 R26.2 R27.2 R30.1
N$44: C103.+ R27.1
N$45: C102.+ R26.1
N$46: IC10.9(C:-IN) R32.2 R34.1
N$47: C19.2 IC9.14(D:OUT) R29.2 R31.1
N$48: IC10.6(B:-IN) R31.2 R33.1
N$49: C20.2 IC9.8(C:OUT) R30.2 R32.1
N$50: IC34.8(C:OUT) IC34.9(C:-IN) R17.1
N$51: IC34.6(B:-IN) IC34.7(B:OUT) R15.1
N$52: C142.1 R17.2 R18.1
N$53: C18.1 IC34.3(A:+IN) R16.2
N$54: C29.2 C140.+ IC34.1(A:OUT) IC34.2(A:-IN)
N$55: C29.1 R15.2 R16.1
N$56: C139.1 IC34.12(D:+IN) R18.2
N$58: C21.+ C142.2 IC34.13(D:-IN) IC34.14(D:OUT)
N$59: IC35.13(D:-IN) R44.2 R47.1
N$61: C16.2 IC35.1(A:OUT) R43.1 R131.2
N$62: IC35.9(C:-IN) R9.1 R43.2
N$63: C17.2 IC35.7(B:OUT) R42.2 R44.1
N$64: C120.- R13.2 R902.2
N$65: C119.- R48.2 R901.2
N$66: C120.+ IC35.14(D:OUT) R47.2
N$67: C119.+ IC35.8(C:OUT) R9.2
N$69: C17.1 IC35.6(B:-IN) R41.2 R42.1 R59.2
N$70: C16.1 IC35.2(A:-IN) R39.2 R58.2 R131.1
PCM_CH1: IC34.10(C:+IN) ; also sheet 3
PCM_CH2: IC34.5(B:+IN) ; also sheet 3
PCM_L: C140.- R38.1
PCM_R: C21.- R40.1
Unconnected: IC10.1(A:OUT) IC10.2(A:-IN) IC10.13(D:-IN) IC10.14(D:OUT)

### Notes on the sheet
- Cart Audio Stage 1 | Cart Audio Stage 2
- Audio Final Stage
- NP
- PCM Amp
- NP

## Library data of the parts
C15 C21 C26 C41 C101-C106 C109 C117-C120 C124 C125 C128 C135 C137 C138 C140 C403 C404 C407 C409 C413-C418 C420 C422 C501 C503 C505 C508 = rcl:CPOL-US: POLARIZED CAPACITOR, American symbol; SPICEPREFIX: C
C16-C20 C22 C23 C29 C33 C34 C36 C38-C40 C53-C56 C60 C110 C111 C139 C142 C153 C154 C401 C402 C405 C406 C408 C411 C412 C419 C423 C430 C502 C504 C506 C507 C509 = rcl:C-US: CAPACITOR, American symbol; SPICEPREFIX: C
C121 C122 = My_Devices:C-US: CAPACITOR, American symbol
IC1 = My_Devices:TLV1117
IC9 IC10 IC45 = linear:LM324: OP AMP
IC14 IC21 = My_Devices:TC51832F-10
IC15 = My_Devices:315-5476A
IC33 = My_Devices:LC7881M
IC34 = My_Devices:NJM844G: OP AMP
IC35 = linear:MC33079: OP AMP
IC37 IC38 = linear:*4558: OP AMP
IC39 = 74xx-us:74*244: Octal BUFFER and LINE DRIVER, 3-state
IC40 = 40xx:4053: Triple 2-channel ANALOG MULTIPLEXER
IC43 = My_Devices:PST529
Q7 Q8 Q101-Q103 = transistor-neu-to92:*-NPN-: NPN Transistror
Q14 = transistor-pnp:MMBT3906*: PNP Transistror
R9 R13 R15-R18 R21-R27 R29-R34 R38-R48 R58 R59 R65-R67 R76-R79 R100 R101 R103-R107 R129-R131 R901 R902 = rcl:R-US_: RESISTOR, American symbol; SPICEPREFIX: R
R19 R28 R50-R55 R84-R88 R90-R99 R102 = My_Devices:R-US_: RESISTOR, American symbol
SUB_CN = My_Devices:PAC_SUB_2X40